# EAGLE design LVDStoCMOS_DB9 (EAGLE 7.1.0)
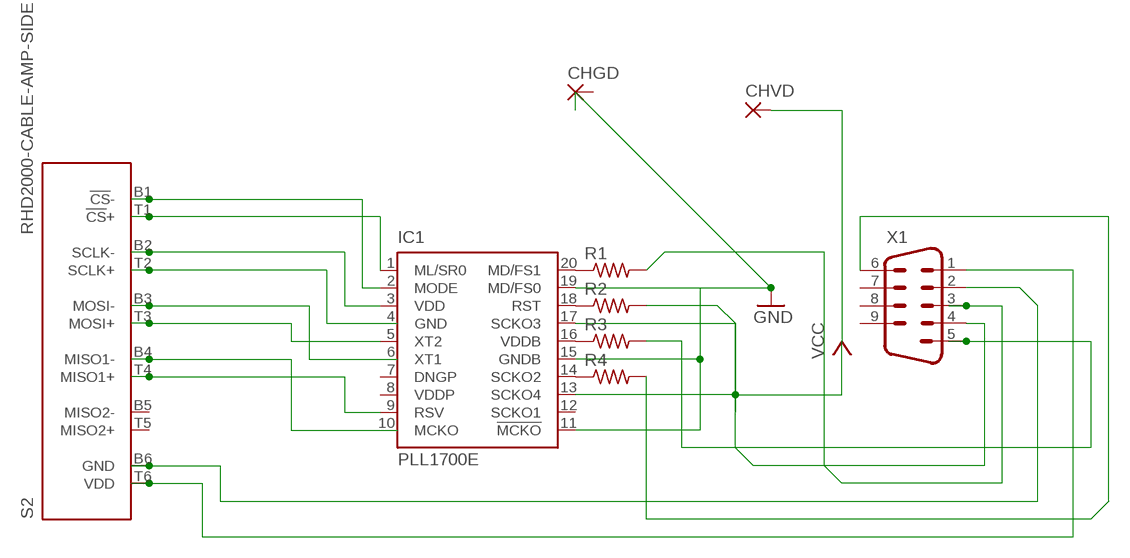
[diagram p0: schematic, sheet 1]

## Parts
CHGD  1,6/0,8  [1,6/0,8]
CHVD  1,6/0,8  [1,6/0,8]
IC1  PLL1700E  [SSOP20]
R1  R-US_R0402  [R0402]
R2  R-US_R0402  [R0402]
R3  R-US_R0402  [R0402]
R4  R-US_R0402  [R0402]
S2  RHD2000-CABLE-AMP-SIDE  [OMNETICS_PZN-12-AA]
X1  M09H  [M09H]

## Nets
GND: IC1.11(!MCKO) IC1.15(GNDB) IC1.19(MD/FS0)
N$1: IC1.20(MD/FS1) R1.1
N$2: IC1.18(RST) R2.1
N$3: IC1.16(VDDB) R3.1
N$4: IC1.14(SCKO2) R4.1
N$5: IC1.2(MODE) S2.B1(!CS!-)
N$6: CHVD.1(P) IC1.13(SCKO4) IC1.17(SCKO3)
N$7: IC1.1(ML/SR0) S2.T1(!CS!+)
N$8: IC1.3(VDD) S2.B2(SCLK-)
N$9: S2.T2(SCLK+)
N$10: S2.B3(MOSI-)
N$11: IC1.5(XT2) S2.T3(MOSI+)
N$12: IC1.9(RSV) S2.T4(MISO1+)
N$13: R1.2 X1.3
N$14: S2.B6(GND) X1.2
N$15: S2.T6(VDD) X1.1
N$17: S2.B4(MISO1-)
N$18: R2.2 X1.4
N$19: R3.2 X1.5
N$20: R4.2 X1.6
Unconnected: CHGD.1(P) IC1.6(XT1) IC1.10(MCKO) IC1.12(SCKO1) S2.B5(MISO2-) S2.T5(MISO2+) X1.7 X1.8 X1.9

## Power pins joined to a net without a drawn wire
DNGP: IC1.7(DNGP)
GND: IC1.4(GND)
VDDP: IC1.8(VDDP)

## Library data of the parts
CHGD CHVD = wirepad:1,6/0,8: THROUGH-HOLE PAD
IC1 = texas:PLL1700*: MULTI-CLOCK GENERATOR GENERATED AUDIO SYSTEM CLOCK Phase Lock Loop (PLL).; MF: TEXAS INSTRUMENT CONNECTORS; MPN: PLL1700E; OC_FARNELL: unknown; OC_NEWARK: 36K3452
R1-R4 = resistor:R-US_: RESISTOR, American symbol
S2 = RHD2000:RHD2000-CABLE-AMP-SIDE: Omnetics A79623 PZN-12-AA connector for SPI interface (amplifier side)
X1 = con-subd:M09: SUB-D; OC_FARNELL: unknown; OC_NEWARK: unknown

## Board
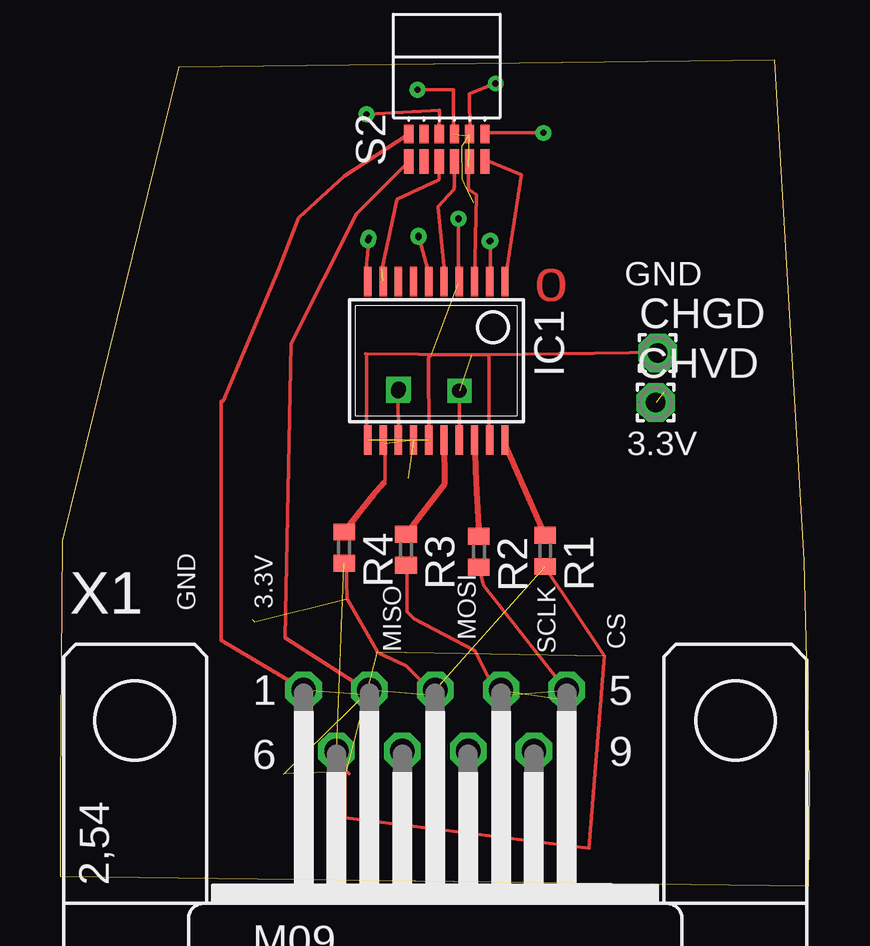
[diagram p1: board, top side]
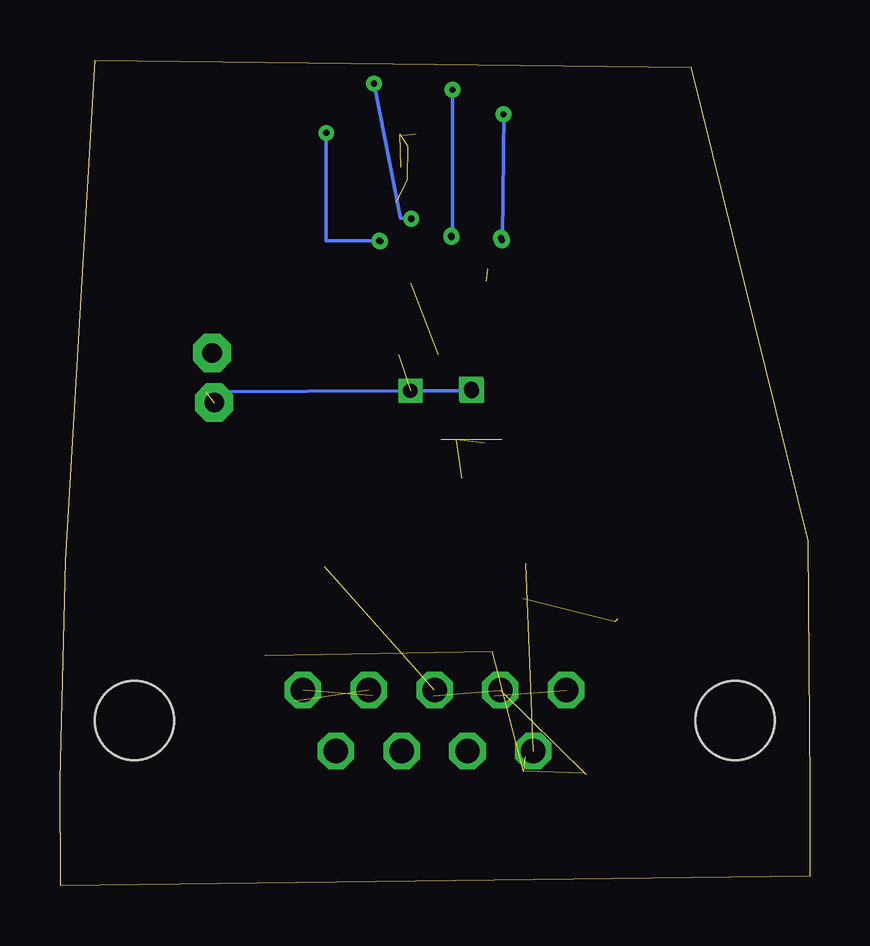
[diagram p2: board, bottom side, seen from below]

Size 31.26 x 34.41 mm. Coordinates in mm from the lower left corner, seen from the top.
Outline: 0,0.4 31.23,0 31.26,4.39 31.03,13.55 29.8,34.41 4.95,34.11 0.09,14.37 0.01,4.1 0,0.4
Copper layers (1*16): Top 0.035mm / dielectric 1.5mm / Bottom 0.035mm
Design rules "default": minimum track width 10mil, minimum drill 24mil, track to track 8mil, track to pad 8mil, pad to pad 8mil, via to via 8mil, smd to smd 8mil, copper to edge 40mil, drill to drill 8mil, minimum pad ring 10mil, minimum via ring 8mil, stop-mask expansion 4mil, vias tented up to drill 0mil, thermal gap 10mil

### Footprints (pad centres in the part's own frame; a part is rotated, then mirrored left to right if it is on the bottom)
1,6/0,8 = drill 0.813 pad 1.6 octagon: 1 0,0
SSOP20 = smd 0.305 x 1.245: 1 -2.857,-3.302; 2 -2.222,-3.302; 3 -1.587,-3.302; 4 -0.952,-3.302; 5 -0.317,-3.302; 6 0.318,-3.302; 7 0.953,-3.302; 8 1.588,-3.302; 9 2.223,-3.302; 10 2.858,-3.302; 11 2.858,3.302; 12 2.223,3.302; 13 1.588,3.302; 14 0.953,3.302; 15 0.318,3.302; 16 -0.317,3.302; 17 -0.952,3.302; 18 -1.587,3.302; 19 -2.222,3.302; 20 -2.857,3.302
R0402 = smd 0.7 x 0.9: 1 -0.65,0; 2 0.65,0
OMNETICS_PZN-12-AA = smd 0.381 x 0.762: B1 1.587,-1.016; B2 0.953,-1.016; B3 0.318,-1.016; B4 -0.318,-1.016; B5 -0.953,-1.016; B6 -1.587,-1.016 | smd 0.381 x 1.016: T1 1.587,-2.159; T2 0.953,-2.159; T3 0.318,-2.159; T4 -0.318,-2.159; T5 -0.953,-2.159; T6 -1.587,-2.159
M09H = drill 1.016 octagon: 1 -5.486,1.27; 2 -2.743,1.27; 3 0,1.27; 4 2.743,1.27; 5 5.486,1.27; 6 -4.115,-1.27; 7 -1.372,-1.27; 8 1.372,-1.27; 9 4.115,-1.27 | hole 3.302: 12.522,0; -12.522,0

### Placement (x,y rotation side)
CHGD  24.92,22.2 0 top
CHVD  24.83,20.13 0 top
IC1  15.7,21.88 180 top
R1  20.23,13.95 270 top
R2  17.47,13.92 270 top
R3  14.43,14 270 top
R4  11.85,14.09 270 top
S2  16.13,32.33 0 top
X1  15.64,6.89 0 top

### Tracks (layer width: path | path; a pad name or v marks a point on that pad's centre or on a via)
GND  (via drill 0.25 pad 0.25)  (3 unrouted)
  Top 0.152: IC1.4 16.65,25.1 16.62,25.1 v16.62,27.81 | 16.98,31.25 17.07,31.34 17.1,31.34 17.08,33 v18.17,33.43 | 15.34,25.66 v14.95,27.08 | 16.42,31.31 16.4,31.33 16.4,33.17 v14.9,33.17 | 16.42,31.31 | IC1.19 17.88,18.61 17.88,22.13 | 17.88,22.13 17.81,22.13 15.49,22.13 15.36,22 IC1.15 | IC1.11 12.78,18.64 12.78,22.1 | 17.88,22.13 25.19,22.23
  Bottom 0.152: v14.95,27.08 14.9,27.08 v14.9,33.17 | v16.62,27.81 17.07,27.81 v18.17,33.43
N$1
  Top 0.254: IC1.20 18.55,18.51 arc45 18.55,18.4 R1.1
N$2
  Top 0.254: IC1.18 17.35,16.81 R2.1
N$3
  Top 0.254: IC1.16 16.02,16.74 R3.1
N$4  (2 unrouted)
  Top 0.152: 13.51,16.79 13.55,16.92 13.55,18.44
  Top 0.254: 13.51,16.79 13.04,16.24 R4.1
N$5  (via drill 0.25 pad 0.25)
  Top 0.152: 17.72,31.11 S2.B1 17.72,31.37 v20.16,31.37 | IC1.2 17.95,25.18 v17.95,26.88
  Bottom 0.152: v17.95,26.88 20.16,26.88 v20.16,31.37
N$6  (via drill 0.6)  (2 unrouted)
  Top 0.152: IC1.13 v14.09,20.62 | IC1.17 16.65,18.87 v16.65,20.63 | 12.74,22.16 17.15,22.13
  Bottom 0.152: 25.2,20.59 v16.65,20.63 v14.09,20.62
N$7
  Top 0.152: IC1.1 19.24,29.63 17.72,30.25 S2.T1
N$8  (5 unrouted)
  Top 0.152: 17.04,29.94 17.04,29.03 17.36,28.79 IC1.3
N$11
  Top 0.152: IC1.5 16.05,25.4 15.77,28.3 16.43,29.02 16.43,29.12 16.45,29.13 S2.T3
N$12  (1 unrouted)
  Top 0.152: 13.43,25.71 14.06,28.6 15.81,29.41 S2.T4
N$13  (1 unrouted)
N$14  (9 unrouted)
  Top 0.152: S2.B6 | S2.B6 11.83,29.56 9.96,27.84 9.13,25.72 6.8,20.19 6.72,20.19 6.72,10.23 10.62,7.91 | 11.94,4.78 12.05,4.67 | 20.24,13.26 22.71,9.59 22.05,1.56 11.89,2.83 11.89,5.37 | 11.92,13.45 11.96,11.96 13.23,9.74 13.21,9.72 14.43,9.18 15.7,7.91
N$15  (1 unrouted)
  Top 0.152: S2.T6 12.37,28.01 9.64,22.59 9.38,10.33 13.16,7.91
N$16  (via drill 0.6)
  other vias: 14.13,20.71
N$17  (via drill 0.25 pad 0.25)
  Top 0.152: 12.76,25.67 v12.88,27 | v12.78,32.14 15.83,32.31 S2.B4
  Bottom 0.152: v12.88,27 12.82,27 12.76,32.23 12.78,32.21 v12.78,32.14
N$18  (1 unrouted)
  Top 0.152: R2.2 17.66,12.51 21.47,7.7
N$19  (1 unrouted)
  Top 0.152: R3.2 14.47,13.56 14.47,11.41 14.76,11.13 17.3,9.8 18.24,7.91
N$20  (1 unrouted)
N$22  (via drill 0.25 pad 0.25)
  other vias: 12.84,26.9
N$23  (via drill 0.25 pad 0.25)
  other vias: 14.94,27.03
N$24  (via drill 0.25 pad 0.25)
  other vias: 16.62,27.78
N$25  (via drill 0.25 pad 0.25)
  other vias: 17.91,26.86

### Text on the board
Top: o
tNames: GND | 3.3V | 3.3V | GND | MISO | MOSI | SCLK | CS